# Altium schematic sheet power.SchDoc
size A4; SheetNumber: 5; SheetTotal: 7; NameOfSheet: Power
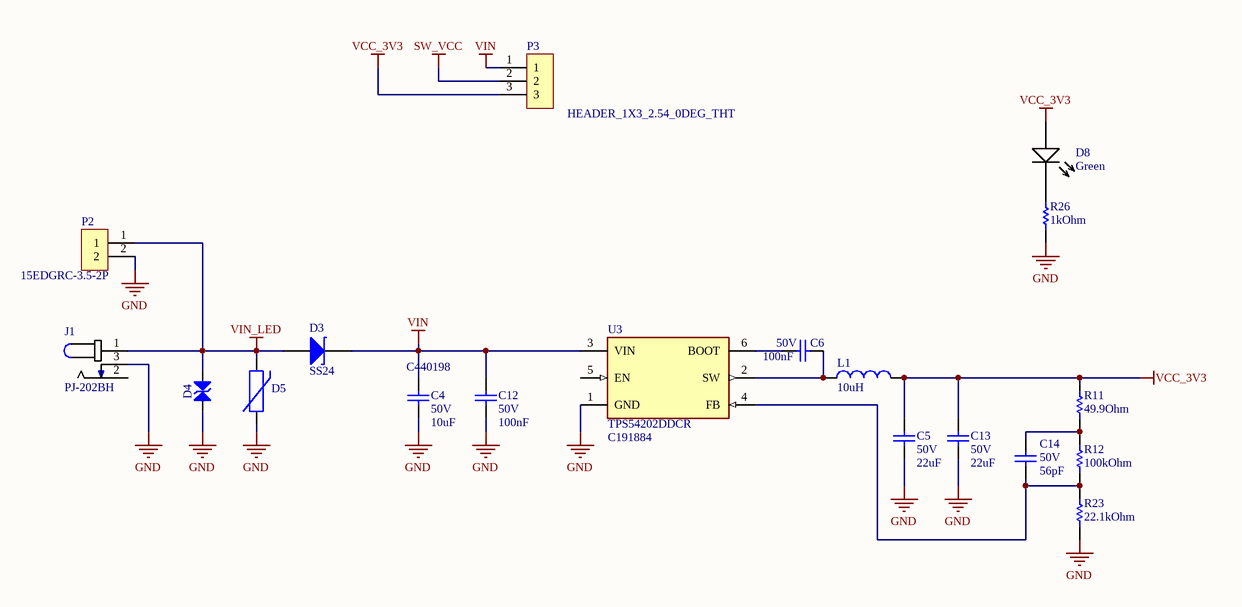
[diagram p0: power.SchDoc]

## Parts
C4  Voltage: 50V  Capacitance: 10uF  Supplier Part Number 1: C440198  [CAP_0805_High_density]  (hidden comment: 10uF 0805 50V)
C5  Voltage: 50V  Capacitance: 22uF  [CAP_0805_High_density]  (hidden comment: 22uF 0805 50V)
C6  Voltage: 50V  Capacitance: 100nF  [CAP_0603_High_density]
C12  Voltage: 50V  Capacitance: 100nF  [CAP_0603_High_density]
C13  Voltage: 50V  Capacitance: 22uF  [CAP_0805_High_density]  (hidden comment: 22uF 0805 50V)
C14  Voltage: 50V  Capacitance: 56pF  [CAP_0603_High_density]  (hidden comment: 56pF 0603 50V)
D3  SS24  [DO214AA]
D4  SMCJ15CA  [DIOM7959X262N]  (value not drawn)
D5  C283933  [SIOV-S14K50]  (value not drawn)
D8  Colour: Green  [LED_0603]  (hidden comment: C205450)
J1  PJ-202BH  [CUI_PJ-202BH]
L1  Inductance: 10uH  [INDP8080X42N]  (hidden comment: NR8040T100M)
P2  15EDGRC-3.5-2P  [15EDGRC-3.5 - 2 pin]
P3  HEADER_1X3_2.54_0DEG_THT  [HDR1X3_2.54]
R11  Resistance: 49.9Ohm  [RES_0603]  (hidden comment: 0603 49.9Ohm 1%)
R12  Resistance: 100kOhm  [RES_0603]  (hidden comment: 0603 100kOhm 1%)
R23  Resistance: 22.1kOhm  [RES_0603]  (hidden comment: 0603 22.1kOhm 1%)
R26  Resistance: 1kOhm  [RES_0603]  (hidden comment: 0603 1kOhm 1%)
U3  TPS54202DDCR  Supplier Part Number 1: C191884  [FP-DDC0006A-MFG]

## Nets
GND: C4.1 C5.1 C12.2 C13.1 D4.2(A) D5.1 J1.3 P2.2 R23.2 R26.1 U3.1(GND)
SW_VCC: P3.2
VCC_3V3: C5.2 C13.2 D8.A L1.2 P3.3 R11.1
VIN: C4.2 C12.1 D3.K P3.1 U3.3(VIN)
VIN_LED: D3.A D4.1(C) D5.2 J1.1 P2.1
NetC6_1: C6.1 U3.6(BOOT)
NetC6_2: C6.2 L1.1 U3.2(SW)
NetC14_1: C14.1 R12.2 R23.1 U3.4(FB)
NetC14_2: C14.2 R11.2 R12.1
NetD8_C: D8.C R26.2

Not connected (* = marked no-connect by the designer): J1 2; U3 5(EN)

## Notes on the sheet
- Author:
- Sheet:
- /
- Issue date:
- Project name:
- Revision:
- Date:
- Page name:

## Library data of the parts
C4 C5 C13 C14 = Capacitor SMD_1: Generic Ceramic Capacitor SMD; Tolerance: 0%; Temperature Coefficient: *; Package: 0805; Supplier 1: LCSC
  C4: Manufacturer Part Number: 10uF 0805 50V
  C5 C13: Manufacturer Part Number: 22uF 0805 50V; Supplier Part Number 1: C98190
  C14: Manufacturer Part Number: 56pF 0603 50V; Supplier Part Number 1: C39148
C6 C12 = Capacitor SMD: Generic Ceramic Capacitor SMD; Temperature Coefficient: X7R; Tolerance: 10%; Package: 0603; Supplier 1: LCSC; Supplier Part Number 1: C282519
D3 = Dioda prostownicza Schottky: 40V Single 500mV@2A 2A DO-214AA Schottky Barrier Diodes (SBD) ROHS; Typ obudowy: SMA; Opis: Dioda prostownicza Schottky; Wartość: SS24; Supplier 1: LCSC; Supplier Part Number 1: C2845097
D4 = SMCJ15CA: 24.4V Clamp 61.5A Ipp Tvs Diode Surface Mount DO-214AB (SMCJ); Part Number: SMCJ28CA; Part Description: Bi-Directional Transient Voltage Suppressor Diode; Manufacturer: LITTELFUSE; Voltage: 28V; Power: 1500W; Table: Diodes; Component Kind: Standard; Component Type: Standard; Device: SMCJ15CA; PackageDescription: DO-214-AB/SMC Molded Diode, Body 7.9x5.9mm, IPC Medium Density; Manufacturer Part Number: SMCJ15CA; Pin Count: 2; Case: DO-214AB; Mounted: Yes; Socket: No; SMD: Yes; ComponentHeight: 2.62mm; HelpURL: \\cern.ch\dfs\Applications\Altium\Datasheets\SMCJ.pdf; Author: CERN DEM JLC; CreateDate: 2009-01-20; LatestRevisionDate: 2010-10-26; Parameter 1: *; Supplier 1: LCSC; Supplier Part Number 1: C720069
D5 = B72214S0500K101: 82V 4.5kA Varistor 1 Circuit Through Hole Disc 14mm; Supplier Part Number 1: C283933; Supplier 1: LCSC; Manufacturer Part Number: C283933
D8 = LED diode: Generic LED diode SMD Green; Forward current: 0mA; Forward Voltage: 0V; Manufacturer Part Number: C205450; Supplier 1: LCSC; Supplier Part Number 1: C205450
J1 = PJ-202BH: 2.5 x 6.5 mm, 5.0 A, Horizontal, Through Hole, Kinked Pins, Dc Power Jack Connector; MP: PJ-202BH; Supplier Part Number 1: C2851165; Supplier 1: LCSC; Supplier 2: Mouser; Supplier Part Number 2: 490-PJ-202BH; Manufacturer Part Number: PJ-202BH
L1 = NR8040T100M: 10µH Shielded Wirewound Inductor 3.1A 44.2mOhm Max Nonstandard; Supplier 1: LCSC; Supplier Part Number 1: C168127; Rated Current: 3.1A
P2 = 15EDGRC-3.5-2P: 15EDGRC-3.5 - 2 pin; Manufacturer Part Number: 15EDGRC-3.5-2P; Supplier 1: LCSC; Supplier Part Number 1: C61791
P3 = Header 1x3: 3pin 1x3 2.54mm 0.100" pitch header vertical tht; Manufacturer Part Number: HEADER_1X3_2.54_0DEG_THT; Supplier 1: LCSC; Supplier Part Number 1: C5360899
R11 R12 R23 R26 = Resistor SMD_1: Generic Resistor SMD; Supplier 1: LCSC
  R11: Manufacturer Part Number: 0603 49.9Ohm 1%; Supplier Part Number 1: C23185
  R12: Manufacturer Part Number: 0603 100kOhm 1%; Supplier Part Number 1: C25803
  R23: Manufacturer Part Number: 0603 22.1kOhm 1%; Supplier Part Number 1: C137768
  R26: Manufacturer Part Number: 0603 1kOhm 1%; Supplier Part Number 1: C3016283
U3 = TPS54202DDCR: IC REG BUCK ADJ 2A TSOT23-6; Switching Frequency: 500kHz; Quiescent Current: 40uA; Max Output Voltage: 28V; Output Configuration: Positive; Min Output Voltage: 596mV; Min Input Voltage: 4.5V; Synchronous Rectifier: Yes; Output Type: Adjustable; Number of Outputs: 1; Packaging: Tape and Reel; Case/Package: SOT-23-6; RoHS Compliant: Yes; Max Input Voltage: 28V; Max Operating Temperature: 125°C; Min Operating Temperature: -40°C; Output Current: 2A; Lead Free: Lead Free; Mount: Surface Mount; Supplier 1: LCSC